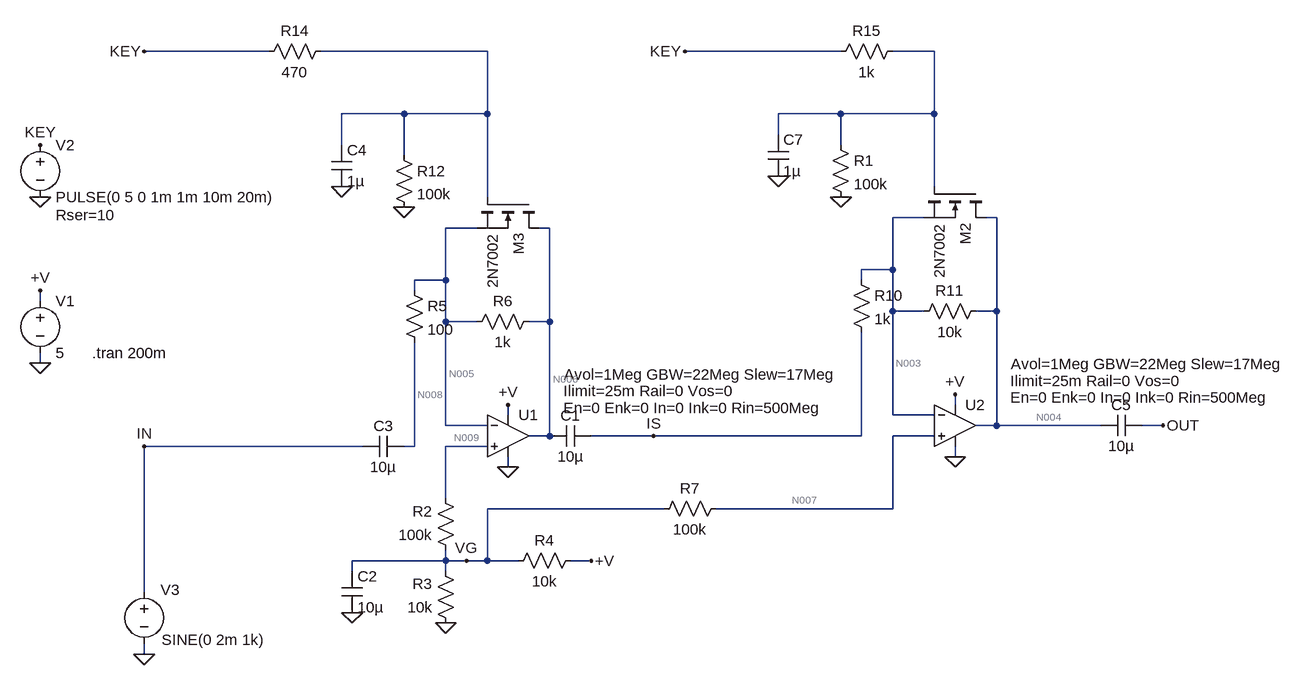
[diagram p0: schematic AFAmp.asc]
AFAmp.asc, the LTspice schematic file:
Version 4
SHEET 1 2580 1876
WIRE 128 64 -64 64
WIRE 464 64 208 64
WIRE 1008 64 768 64
WIRE 1152 64 1088 64
WIRE 336 160 240 160
WIRE 464 160 464 64
WIRE 464 160 336 160
WIRE 1008 160 912 160
WIRE 1152 160 1152 64
WIRE 1152 160 1008 160
WIRE 912 192 912 160
WIRE 240 208 240 160
WIRE 1008 208 1008 160
WIRE 336 224 336 160
WIRE 1152 272 1152 160
WIRE 464 288 464 160
WIRE 1136 320 1088 320
WIRE 1248 320 1232 320
WIRE 448 336 400 336
WIRE 560 336 544 336
WIRE 1088 400 1088 320
WIRE 1088 400 1040 400
WIRE 400 416 400 336
WIRE 400 416 352 416
WIRE 1040 416 1040 400
WIRE 352 432 352 416
WIRE -224 448 -224 432
WIRE 1088 464 1088 400
WIRE 1136 464 1088 464
WIRE 1248 464 1248 320
WIRE 1248 464 1216 464
WIRE 400 480 400 416
WIRE 448 480 400 480
WIRE 560 480 560 336
WIRE 560 480 528 480
WIRE -224 544 -224 528
WIRE 1184 608 1184 592
WIRE 496 624 496 608
WIRE 1088 624 1088 464
WIRE 1152 624 1088 624
WIRE 400 640 400 480
WIRE 464 640 400 640
WIRE 1248 640 1248 464
WIRE 1248 640 1216 640
WIRE 1408 640 1248 640
WIRE 1504 640 1472 640
WIRE 560 656 560 480
WIRE 560 656 528 656
WIRE 720 656 624 656
WIRE 1040 656 1040 496
WIRE 1040 656 720 656
WIRE 1152 656 1088 656
WIRE 272 672 -64 672
WIRE 352 672 352 512
WIRE 352 672 336 672
WIRE 464 672 400 672
WIRE 1184 688 1184 672
WIRE 496 704 496 688
WIRE 400 752 400 672
WIRE 736 768 464 768
WIRE 1088 768 1088 656
WIRE 1088 768 816 768
WIRE 400 848 400 832
WIRE 400 848 256 848
WIRE 432 848 400 848
WIRE 464 848 464 768
WIRE 464 848 432 848
WIRE 512 848 464 848
WIRE 624 848 592 848
WIRE 256 864 256 848
WIRE 400 864 400 848
WIRE -64 896 -64 672
WIRE -64 992 -64 976
FLAG 496 704 0
FLAG -224 544 0
FLAG -224 432 +V
FLAG -64 992 0
FLAG 496 608 +V
FLAG 1504 640 OUT
FLAG 624 848 +V
FLAG 256 928 0
FLAG 400 944 0
FLAG 1184 688 0
FLAG 1184 592 +V
FLAG 720 656 IS
FLAG -64 672 IN
FLAG 432 848 VG
FLAG -224 288 0
FLAG -224 208 KEY
FLAG 1008 288 0
FLAG 336 304 0
FLAG 240 272 0
FLAG -64 64 KEY
FLAG 912 256 0
FLAG 768 64 KEY
SYMBOL voltage -224 432 R0
WINDOW 123 0 0 Left 0
WINDOW 39 0 0 Left 0
SYMATTR InstName V1
SYMATTR Value 5
SYMBOL voltage -64 880 R0
WINDOW 0 25 13 Left 2
WINDOW 3 27 90 Left 2
WINDOW 123 27 116 Left 2
WINDOW 39 0 0 Left 0
SYMATTR InstName V3
SYMATTR Value SINE(0 2m 1k)
SYMBOL UniversalOpAmp2 496 656 R0
WINDOW 123 86 -95 Left 2
WINDOW 39 85 -69 Left 2
WINDOW 40 85 -43 Left 2
SYMATTR Value2 Avol=1Meg GBW=22Meg Slew=17Meg
SYMATTR InstName U1
SYMBOL res 416 848 R180
WINDOW 0 36 76 Left 2
WINDOW 3 36 40 Left 2
SYMATTR InstName R2
SYMATTR Value 100k
SYMBOL res 416 960 R180
WINDOW 0 36 76 Left 2
WINDOW 3 36 40 Left 2
SYMATTR InstName R3
SYMATTR Value 10k
SYMBOL res 496 864 R270
WINDOW 0 32 56 VTop 2
WINDOW 3 0 56 VBottom 2
SYMATTR InstName R4
SYMATTR Value 10k
SYMBOL cap 240 864 R0
SYMATTR InstName C2
SYMATTR Value 10µ
SYMBOL cap 336 656 R90
WINDOW 0 0 32 VBottom 2
WINDOW 3 32 32 VTop 2
SYMATTR InstName C3
SYMATTR Value 10µ
SYMBOL cap 624 640 R90
WINDOW 0 0 32 VBottom 2
WINDOW 3 32 32 VTop 2
SYMATTR InstName C1
SYMATTR Value 10µ
SYMBOL res 336 416 R0
SYMATTR InstName R5
SYMATTR Value 100
SYMBOL res 544 464 R90
WINDOW 0 0 56 VBottom 2
WINDOW 3 32 56 VTop 2
SYMATTR InstName R6
SYMATTR Value 1k
SYMBOL UniversalOpAmp2 1184 640 R0
WINDOW 123 86 -95 Left 2
WINDOW 39 85 -69 Left 2
WINDOW 40 85 -43 Left 2
SYMATTR Value2 Avol=1Meg GBW=22Meg Slew=17Meg
SYMATTR InstName U2
SYMBOL res 1024 400 R0
SYMATTR InstName R10
SYMATTR Value 1k
SYMBOL res 1232 448 R90
WINDOW 0 0 56 VBottom 2
WINDOW 3 32 56 VTop 2
SYMATTR InstName R11
SYMATTR Value 10k
SYMBOL res 720 784 R270
WINDOW 0 32 56 VTop 2
WINDOW 3 0 56 VBottom 2
SYMATTR InstName R7
SYMATTR Value 100k
SYMBOL voltage -224 192 R0
WINDOW 123 0 0 Left 0
WINDOW 39 24 124 Left 2
SYMATTR SpiceLine Rser=10
SYMATTR InstName V2
SYMATTR Value PULSE(0 5 0 1m 1m 10m 20m)
SYMBOL cap 1472 624 R90
WINDOW 0 0 32 VBottom 2
WINDOW 3 32 32 VTop 2
SYMATTR InstName C5
SYMATTR Value 10µ
SYMBOL nmos 1232 272 R90
SYMATTR InstName M2
SYMATTR Value 2N7002
SYMBOL res 992 192 R0
SYMATTR InstName R1
SYMATTR Value 100k
SYMBOL nmos 544 288 R90
SYMATTR InstName M3
SYMATTR Value 2N7002
SYMBOL res 320 208 R0
SYMATTR InstName R12
SYMATTR Value 100k
SYMBOL cap 224 208 R0
SYMATTR InstName C4
SYMATTR Value 1µ
SYMBOL res 224 48 R90
WINDOW 0 0 56 VBottom 2
WINDOW 3 32 56 VTop 2
SYMATTR InstName R14
SYMATTR Value 470
SYMBOL res 1104 48 R90
WINDOW 0 0 56 VBottom 2
WINDOW 3 32 56 VTop 2
SYMATTR InstName R15
SYMATTR Value 1k
SYMBOL cap 896 192 R0
SYMATTR InstName C7
SYMATTR Value 1µ
TEXT -144 528 Left 2 !.tran 200m

The netlist it stands for:
* AFAmp.asc
V1 +V 0 5
V3 IN 0 SINE(0 2m 1k)
XU1 N009 N005 +V 0 N006 level2 Avol=1Meg GBW=22Meg Slew=17Meg Ilimit=25m Rail=0 Vos=0 En=0 Enk=0 In=0 Ink=0 Rin=500Meg  ; pins In+ In- V+ V- OUT
R2 VG N009 100k
R3 0 VG 10k
R4 VG +V 10k
C2 VG 0 10µ
C3 N008 IN 10µ
C1 IS N006 10µ
R5 N005 N008 100
R6 N006 N005 1k
XU2 N007 N003 +V 0 N004 level2 Avol=1Meg GBW=22Meg Slew=17Meg Ilimit=25m Rail=0 Vos=0 En=0 Enk=0 In=0 Ink=0 Rin=500Meg  ; pins In+ In- V+ V- OUT
R10 N003 IS 1k
R11 N004 N003 10k
R7 VG N007 100k
V2 KEY 0 PULSE(0 5 0 1m 1m 10m 20m) Rser=10
C5 OUT N004 10µ
M2 N004 N002 N003 N003 2N7002
R1 N002 0 100k
M3 N006 N001 N005 N005 2N7002
R12 N001 0 100k
C4 N001 0 1µ
R14 N001 KEY 470
R15 N002 KEY 1k
C7 N002 0 1µ
.model NMOS NMOS
.model PMOS PMOS
.lib standard.mos
.tran 200m
.lib UniversalOpAmp2.lib
.backanno
.end

* Results of the author's LTspice run, read from the files saved beside the schematic
* Operating Point, zero values left out:
*   V(+v) = 5 V
*   V(n006) = 2.5 V
*   V(n005) = 2.5 V
*   V(n009) = 2.5 V
*   V(vg) = 2.5 V
*   V(n008) = 2.5 V
*   V(is) = 2.5 V
*   V(n004) = 2.5 V
*   V(n003) = 2.5 V
*   V(n007) = 2.5 V
*   V(out) = 25 µV
*   I(R3) = -250 µA
*   I(R4) = -250 µA
*   I(V1) = -750 µA
*   Ix(u1:3) = 250 µA
*   Ix(u1:4) = -250 µA
*   Ix(u2:3) = 250 µA
*   Ix(u2:4) = -250 µA
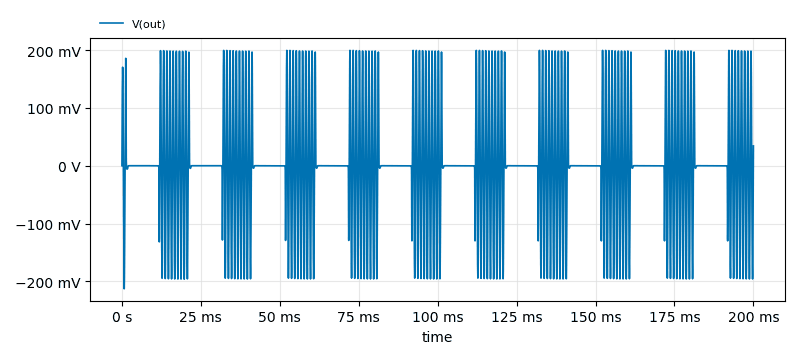
[diagram p1: Transient Analysis of AFAmp.asc, plotted from the saved traces]
* Transient Analysis, 1 run:
*   V(out): min -212.7 mV, max 199.4 mV, average 2.023 mV, rms 95 mV, last 34.23 mV